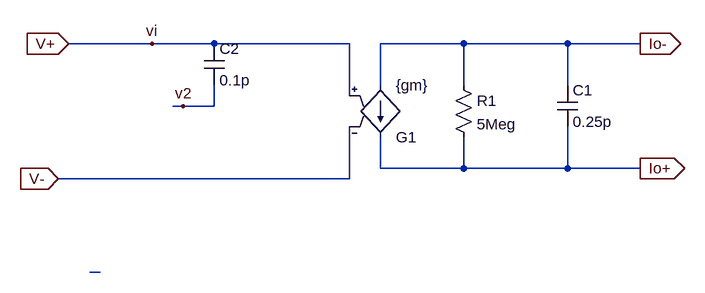
[diagram p0: schematic OTAdif.asc]
OTAdif.asc, the LTspice schematic file:
Version 4
SHEET 1 880 680
WIRE -128 64 -256 64
WIRE -32 64 -128 64
WIRE 176 64 -32 64
WIRE 352 64 224 64
WIRE 512 64 352 64
WIRE 624 64 512 64
WIRE 224 128 224 64
WIRE 352 128 352 64
WIRE 512 128 512 64
WIRE 176 144 176 64
WIRE -80 160 -96 160
WIRE -32 160 -32 128
WIRE -32 160 -80 160
WIRE 224 256 224 208
WIRE 352 256 352 208
WIRE 352 256 224 256
WIRE 512 256 512 192
WIRE 512 256 352 256
WIRE 624 256 512 256
WIRE 176 272 176 192
WIRE 176 272 -272 272
WIRE -208 416 -224 416
FLAG -128 64 vi
FLAG -80 160 v2
FLAG -256 64 V+
IOPIN -256 64 In
FLAG -272 272 V-
IOPIN -272 272 In
FLAG 624 64 Io-
IOPIN 624 64 Out
FLAG 624 256 Io+
IOPIN 624 256 Out
SYMBOL g2 224 224 M180
SYMATTR InstName G1
SYMATTR Value {gm}
SYMBOL cap 496 128 R0
SYMATTR InstName C1
SYMATTR Value 0.25p
SYMBOL res 336 112 R0
SYMATTR InstName R1
SYMATTR Value 5Meg
SYMBOL cap -48 64 R0
SYMATTR InstName C2
SYMATTR Value 0.1p

The netlist it stands for:
* OTAdif.asc
G1 Io- Io+ V+ V- {gm}
C1 Io- Io+ 0.25p
R1 Io- Io+ 5Meg
C2 V+ v2 0.1p
.backanno
.end